# EAGLE design TSOC-FTDI-BASE-2-0 (EAGLE 6.6.0)
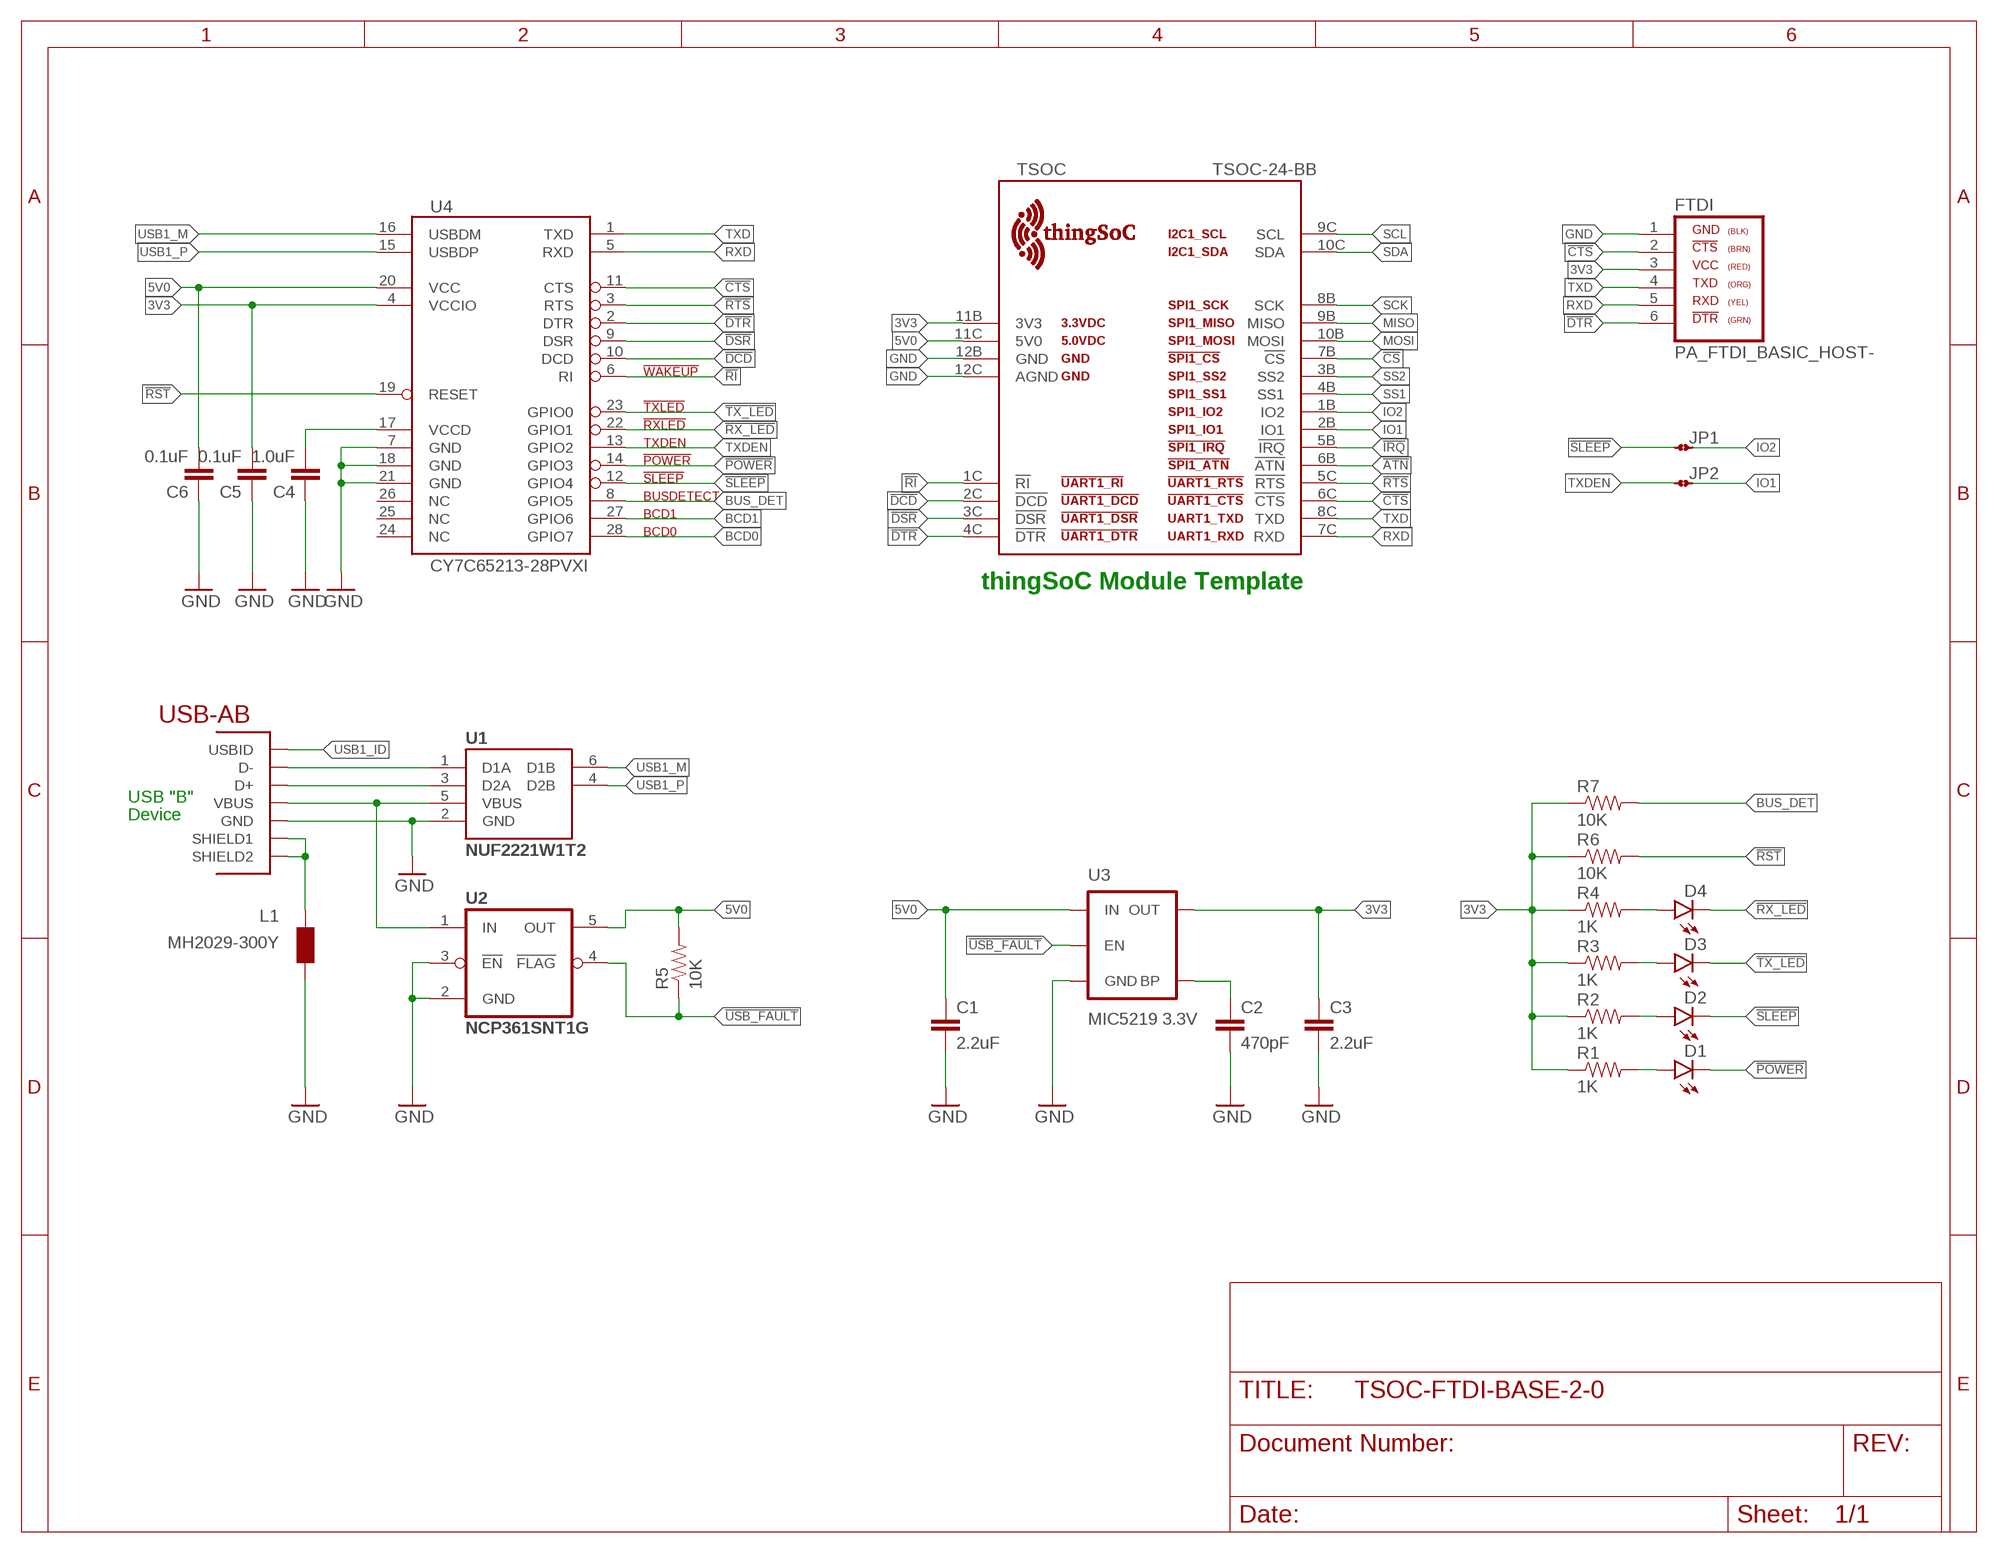
[diagram p0: schematic, sheet 1]

## Parts
C1  2.2uF  CAP0603-CAP  [0603-CAP]
C2  470pF  CAP0603-CAP  [0603-CAP]
C3  2.2uF  CAP0603-CAP  [0603-CAP]
C4  1.0uF  CAP0603-CAP  [0603-CAP]
C5  0.1uF  CAP0603-CAP  [0603-CAP]
C6  0.1uF  CAP0603-CAP  [0603-CAP]
D1  LED0603  [LED-0603]
D2  LED0603  [LED-0603]
D3  LED0603  [LED-0603]
D4  LED0603  [LED-0603]
FTDI  PA_FTDI_BASIC_HOST-  [PA_FTDI_M5X1]
JP1  JMP-2-NO  [JMP-2-NO]
JP2  JMP-2-NO  [JMP-2-NO]
L1  MH2029-300Y  WE-CBF_0805  [0805]
R1  1K  RESISTOR0603-RES  [0603-RES]
R2  1K  RESISTOR0603-RES  [0603-RES]
R3  1K  RESISTOR0603-RES  [0603-RES]
R4  1K  RESISTOR0603-RES  [0603-RES]
R5  10K  RESISTOR0603-RES  [0603-RES]
R6  10K  RESISTOR0603-RES  [0603-RES]
R7  10K  RESISTOR0603-RES  [0603-RES]
TSOC  TSOC-24-BB  [TSOC-BB-S24]
U1  NUF2221W1T2  [SOT-363]
U2  NCP361SNT1G  [SOP95P275X110-5N]
U3  MIC5219 3.3V  V_REG_MIC52193.3V  [SOT23-5]
U4  CY7C65213-28PVXI  [SSOP28DB]
USB1  USB_AB  [USB-AB-MICRO-SMD]

## Nets
3V3: C3.1 C5.2 FTDI.3 R1.1 R2.1 R3.1 R4.1 R6.1 R7.1 TSOC.11B(3V3) U3.5(OUT) U4.4(VCCIO)
5V0: C1.1 C6.2 R5.2 TSOC.11C(5V0) U2.5(OUT) U3.1(IN) U4.20(VCC)
!ATN: TSOC.6B(!ATN)
!CS: TSOC.7B(!CS)
!CTS: FTDI.2 TSOC.6C(!CTS) U4.11(CTS)
!DCD: TSOC.2C(!DCD) U4.10(DCD)
!DSR: TSOC.3C(!DSR) U4.9(DSR)
!DTR: FTDI.6 TSOC.4C(!DTR) U4.2(DTR)
!IRQ: TSOC.5B(!IRQ)
!POWER: D1.C U4.14(GPIO3)
!RI: TSOC.1C(!RI) U4.6(RI)
!RST: R6.2 U4.19(RESET)
!RTS: TSOC.5C(!RTS) U4.3(RTS)
!RX_LED: D4.C U4.22(GPIO1)
!SLEEP: D2.C JP1.1 U4.12(GPIO4)
!TX_LED: D3.C U4.23(GPIO0)
!USB_FAULT: R5.1 U2.4(!FLAG) U3.3(EN)
BCD0: U4.28(GPIO7)
BCD1: U4.27(GPIO6)
BLUE: D3.A R3.2
BUS_DET: R7.2 U4.8(GPIO5)
BYPASS: C2.1 U3.4(BP)
GND [vcc]: C1.2 C2.2 C3.2 C4.1 C5.1 C6.1 FTDI.1 L1.2 TSOC.12B(GND) TSOC.12C(AGND) U1.2(GND) U2.2(GND) U2.3(!EN) U3.2(GND) U4.7(GND) U4.18(GND) U4.21(GND) USB1.GND
GRN: D1.A R1.2
IO1: JP2.2 TSOC.2B(IO1)
IO2: JP1.2 TSOC.1B(IO2)
MISO: TSOC.9B(MISO)
MOSI: TSOC.10B(MOSI)
RED: D2.A R2.2
RXD: FTDI.5 TSOC.7C(RXD) U4.5(RXD)
SCK: TSOC.8B(SCK)
SCL: TSOC.9C(SCL)
SDA: TSOC.10C(SDA)
SS1: TSOC.4B(SS1)
SS2: TSOC.3B(SS2)
TXD: FTDI.4 TSOC.8C(TXD) U4.1(TXD)
TXDEN: JP2.1 U4.13(GPIO2)
USB1_DM: U1.1(D1A) USB1.D-
USB1_DP: U1.3(D2A) USB1.D+
USB1_ID: USB1.ID(USBID)
USB1_M: U1.6(D1B) U4.16(USBDM)
USB1_P: U1.4(D2B) U4.15(USBDP)
USB1_SHIELD: L1.1 USB1.SHIELD1 USB1.SHIELD2
USB1_VBUS: U1.5(VBUS) U2.1(IN) USB1.VBUS
VCCD: C4.2 U4.17(VCCD)
YEL: D4.A R4.2
Unconnected: U4.24(NC) U4.25(NC) U4.26(NC)

## Notes on the sheet
- thingSoC Module Template
- USB "B"
- Device

## Library data of the parts
C1-C6 = PatternAgents-ProtoPads:CAP: Capacitor Standard 0603 ceramic capacitor, and 0.1" leaded capacitor.
D1-D4 = SparkFun-LED:LED: LEDs Standard schematic elements and footprints for 5mm, 3mm, 1206, and 0603 sized LEDs. 5mm - Spark Fun Electronics SKU : COM-00529 (and others)
FTDI = PatternAgents-Interface:PA_FTDI_BASIC_HOST: PatternAgents FTDI UART BASIC Pattern Pinout for "BASIC" FTDI USB-UART adaptor from Sparkfun and others. Source LBR : http://www.patternagents.com Github : https://github.com/patternagents Source Data : http://www.sparkfun.com/datasheets/DevTools/Arduino/FTDI%20Basic-v21-5V.pdf PA Pattern License : http://creativecommons.org/licenses/by-sa/4.0/ (Creative Commons 4.0) THIS SOFTWARE IS PROVIDED BY THE CONTRIBUTORS "AS IS" AND WITHOUT ANY EXPRESS OR IMPLIED WARRANTIES, INCLUDING, BUT NOT LIMITED TO, THE IMPLIED WARRANTIES OF MERCHANTABILITY AND FITNESS FOR A PARTICULAR PURPOSE ARE DISCLAIMED. IN NO EVENT SHALL THE COPYRIGHT OWNER OR CONTRIBUTORS BE LIABLE FOR ANY DIRECT, INDIRECT, INCIDENTAL, SPECIAL, EXEMPLARY, OR CONSEQUENTIAL DAMAGES (INCLUDING, BUT NOT LIMITED TO, PROCUREMENT OF SUBSTITUTE GOODS OR SERVICES; LOSS OF USE, DATA, OR PROFITS; OR BUSINESS INTERRUPTION) HOWEVER CAUSED AND ON ANY THEORY OF LIABILITY, WHETHER IN CONTRACT, STRICT LIABILITY, OR TORT (INCLUDING NEGLIGENCE OR OTHERWISE) ARISING IN ANY WAY OUT OF THE USE OF THIS SOFTWARE, EVEN IF ADVISED OF THE POSSIBILITY OF SUCH DAMAGE.
JP1 JP2 = PatternAgents-ProtoPads:JMP-2-NO: Two Terminal Jumper - Normally Open Positions 1 and 2 are normally NOT connected. PatternAgents ProtoPads Library Schematic and PCB layout libraries for design patterns by PatternAgents. For the CADSoft Eagle CAD program : http://www.cadsoftusa.com/download-eagle/ Source LBR : http://www.patternagents.com Github : https://github.com/PatternAgents License : http://creativecommons.org/licenses/by-sa/4.0/ (Creative Commons 4.0) THIS SOFTWARE IS PROVIDED BY THE CONTRIBUTORS "AS IS" AND WITHOUT ANY EXPRESS OR IMPLIED WARRANTIES, INCLUDING, BUT NOT LIMITED TO, THE IMPLIED WARRANTIES OF MERCHANTABILITY AND FITNESS FOR A PARTICULAR PURPOSE ARE DISCLAIMED. IN NO EVENT SHALL THE COPYRIGHT OWNER OR CONTRIBUTORS BE LIABLE FOR ANY DIRECT, INDIRECT, INCIDENTAL, SPECIAL, EXEMPLARY, OR CONSEQUENTIAL DAMAGES (INCLUDING, BUT NOT LIMITED TO, PROCUREMENT OF SUBSTITUTE GOODS OR SERVICES; LOSS OF USE, DATA, OR PROFITS; OR BUSINESS INTERRUPTION) HOWEVER CAUSED AND ON ANY THEORY OF LIABILITY, WHETHER IN CONTRACT, STRICT LIABILITY, OR TORT (INCLUDING NEGLIGENCE OR OTHERWISE) ARISING IN ANY WAY OUT OF THE USE OF THIS SOFTWARE, EVEN IF ADVISED OF THE POSSIBILITY OF SUCH DAMAGE.; BOM: EXCLUDE
L1 = wuerth-elektronik:WE-CBF: SMD EMI Suppression Ferrite Beads - excellent anti-EMI properties - low DCR - impedances till 3000 ohms - rated current up to 6 A
R1-R7 = PatternAgents-ProtoPads:RESISTOR: Resistor Basic schematic elements and footprints for 0603, 1206, and PTH resistors.
TSOC = thingSoC:TSOC-24: thingSoC Twenty-Four(24) Pin Socket Source LBR : http://www.thingsoc.com Github : https://github.com/thingsoc License : http://creativecommons.org/licenses/by-sa/4.0/ (Creative Commons 4.0) THIS SOFTWARE IS PROVIDED BY THE CONTRIBUTORS "AS IS" AND WITHOUT ANY EXPRESS OR IMPLIED WARRANTIES, INCLUDING, BUT NOT LIMITED TO, THE IMPLIED WARRANTIES OF MERCHANTABILITY AND FITNESS FOR A PARTICULAR PURPOSE ARE DISCLAIMED. IN NO EVENT SHALL THE COPYRIGHT OWNER OR CONTRIBUTORS BE LIABLE FOR ANY DIRECT, INDIRECT, INCIDENTAL, SPECIAL, EXEMPLARY, OR CONSEQUENTIAL DAMAGES (INCLUDING, BUT NOT LIMITED TO, PROCUREMENT OF SUBSTITUTE GOODS OR SERVICES; LOSS OF USE, DATA, OR PROFITS; OR BUSINESS INTERRUPTION) HOWEVER CAUSED AND ON ANY THEORY OF LIABILITY, WHETHER IN CONTRACT, STRICT LIABILITY, OR TORT (INCLUDING NEGLIGENCE OR OTHERWISE) ARISING IN ANY WAY OUT OF THE USE OF THIS SOFTWARE, EVEN IF ADVISED OF THE POSSIBILITY OF SUCH DAMAGE.
U1 = PatternAgents-OnSemi:NUF2221W1T2: NUF2221W1T2 USB ESD Protection, EMI FIlter, and Line Termination
U2 = PatternAgents-OnSemi:NCP361SNT1G: USB Positive Overvoltage Protection Controller; MPN: NCP361SNT1G; OC_FARNELL: 1642242; OC_NEWARK: 01P0135; PACKAGE: TSOP-5; SUPPLIER: ON Semiconductor
U3 = SparkFun-PowerIC:V_REG_MIC5219: V_REG MIC5219 Standard 3.3V and 5V 500mA LDO voltage regulator in SOT-23 layout. Micrel part MIC5219. BP (by-pass) pin is used to lower output noise with 470pF cap, may be left open.; PROD_ID: VREG-09872
U4 = PatternAgents-Cypress:CY7C65213-28: Cypress EZ-USB ® CY7C65213-28SSOP USB TO UART BRIDGE Full-Speed USB Peripheral Controller Source Data: http://www.cypress.com/?mpn=CY7C65213-28xxxx LBR Source: http://www.patternagents.com THIS SOFTWARE IS PROVIDED BY THE CONTRIBUTORS "AS IS" AND WITHOUT ANY EXPRESS OR IMPLIED WARRANTIES, INCLUDING, BUT NOT LIMITED TO, THE IMPLIED WARRANTIES OF MERCHANTABILITY AND FITNESS FOR A PARTICULAR PURPOSE ARE DISCLAIMED. IN NO EVENT SHALL THE COPYRIGHT OWNER OR CONTRIBUTORS BE LIABLE FOR ANY DIRECT, INDIRECT, INCIDENTAL, SPECIAL, EXEMPLARY, OR CONSEQUENTIAL DAMAGES (INCLUDING, BUT NOT LIMITED TO, PROCUREMENT OF SUBSTITUTE GOODS OR SERVICES; LOSS OF USE, DATA, OR PROFITS; OR BUSINESS INTERRUPTION) HOWEVER CAUSED AND ON ANY THEORY OF LIABILITY, WHETHER IN CONTRACT, STRICT LIABILITY, OR TORT (INCLUDING NEGLIGENCE OR OTHERWISE) ARISING IN ANY WAY OUT OF THE USE OF THIS SOFTWARE, EVEN IF ADVISED OF THE POSSIBILITY OF SUCH DAMAGE.
USB1 = BeeSafe:USB_AB: This is a USB AB connector that is compatible with USB OTG. i.e. this connector can serve as a host or device

## Net classes
1 vcc: width 0.254 mm

## Board
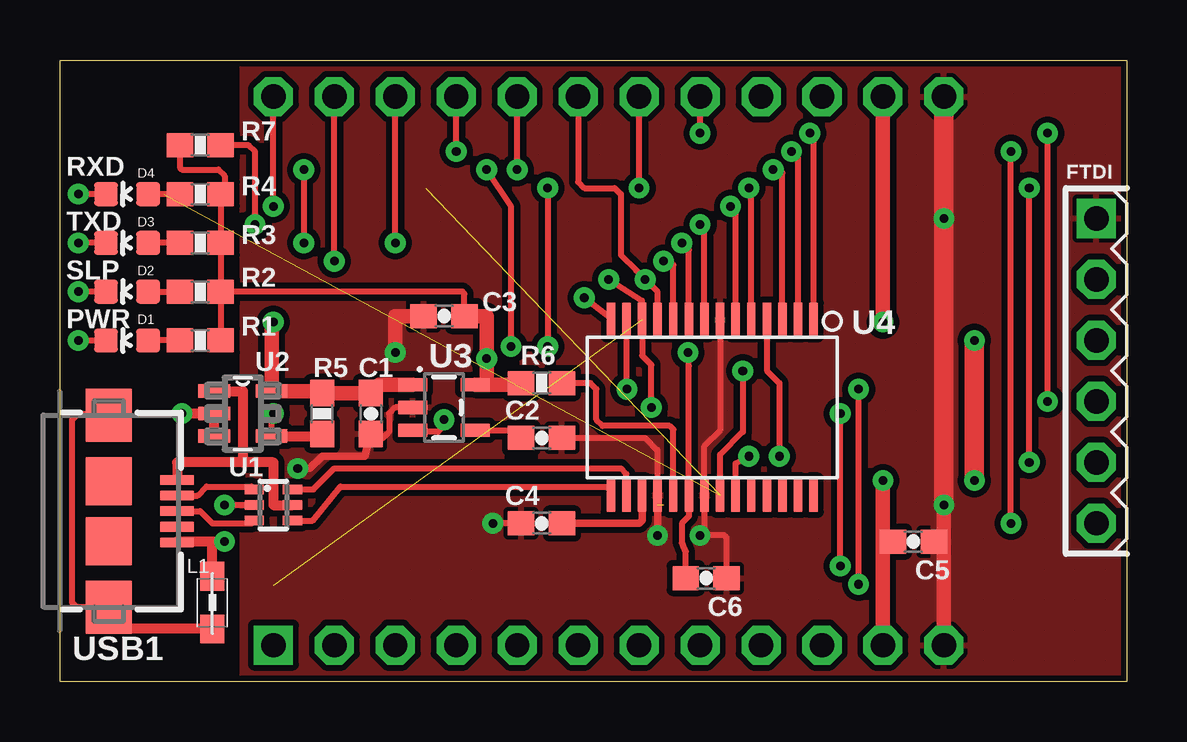
[diagram p1: board, top side]
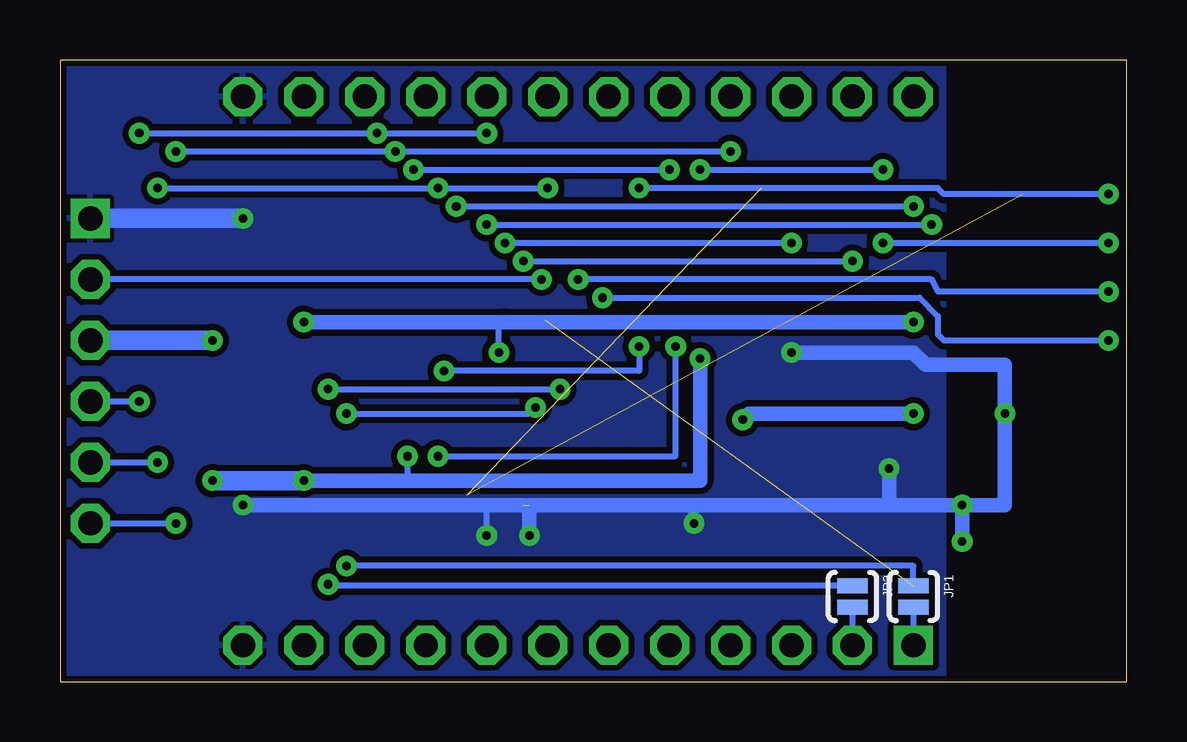
[diagram p2: board, bottom side, seen from below]

Size 44.45 x 25.91 mm. Coordinates in mm from the lower left corner, seen from the top.
Outline: 0,0 0,25.91 44.45,25.91 44.45,0 0,0
Copper layers (1*16): Top 0.035mm / dielectric 1.5mm / Bottom 0.035mm
Design rules "PatternAgents_7mil": minimum track width 7mil, minimum drill 14mil, track to track 7mil, track to pad 7mil, pad to pad 7mil, via to via 7mil, smd to smd 7mil, copper to edge 7mil, drill to drill 7mil, minimum pad ring 12mil, minimum via ring 10mil, stop-mask expansion 4mil, vias tented up to drill 25mil, thermal gap 7mil

### Footprints (pad centres in the part's own frame; a part is rotated, then mirrored left to right if it is on the bottom)
0603-CAP = smd 1.1 x 1: 1 -0.85,0; 2 0.85,0
LED-0603 = smd 1 x 1: A 0,-0.877; C 0,0.877
PA_FTDI_M5X1 = drill 1.016 square: 1 -1.27,6.35 | drill 1.016 octagon: 2 -1.27,3.81; 3 -1.27,1.27; 4 -1.27,-1.27; 5 -1.27,-3.81; 6 -1.27,-6.35
JMP-2-NO = smd 0.635 x 1.27: 1 -0.45,0; 2 0.45,0
0805 = smd 1.2 x 1: 1 -1.1,0; 2 1.1,0
0603-RES = smd 1.1 x 1: 1 -0.85,0; 2 0.85,0
TSOC-BB-S24 = drill 1.016 square: 1B -11.43,-11.43 | drill 1.016 octagon: 1C -11.43,11.43; 2B -8.89,-11.43; 2C -8.89,11.43; 3B -6.35,-11.43; 3C -6.35,11.43; 4B -3.81,-11.43; 4C -3.81,11.43; 5B -1.27,-11.43; 5C -1.27,11.43; 6B 1.27,-11.43; 6C 1.27,11.43; 7B 3.81,-11.43; 7C 3.81,11.43; 8B 6.35,-11.43; 8C 6.35,11.43; 9B 8.89,-11.43; 9C 8.89,11.43; 10B 11.43,-11.43; 10C 11.43,11.43; 11B 13.97,-11.43; 11C 13.97,11.43; 12B 16.51,-11.43; 12C 16.51,11.43
SOT-363 = smd 0.4 x 0.8: 1 -0.65,-0.8; 2 0,-0.8; 3 0.65,-0.8; 4 0.65,0.8; 5 0,0.8; 6 -0.65,0.8
SOP95P275X110-5N = smd 1.321 x 0.559: 1 -1.194,0.94; 2 -1.194,0; 3 -1.194,-0.94; 4 1.194,-0.94; 5 1.194,0.94
SOT23-5 = smd 0.55 x 1.2: 1 -0.95,-1.3; 2 0,-1.3; 3 0.95,-1.3; 4 0.95,1.3; 5 -0.95,1.3
SSOP28DB = smd 0.348 x 1.397: 1 -4.225,-3.656; 2 -3.575,-3.656; 3 -2.925,-3.656; 4 -2.275,-3.656; 5 -1.625,-3.656; 6 -0.975,-3.656; 7 -0.325,-3.656; 8 0.325,-3.656; 9 0.975,-3.656; 10 1.625,-3.656; 11 2.275,-3.656; 12 2.925,-3.656; 13 3.575,-3.656; 14 4.225,-3.656; 15 4.225,3.656; 16 3.575,3.656; 17 2.925,3.656; 18 2.275,3.656; 19 1.625,3.656; 20 0.975,3.656; 21 0.325,3.656; 22 -0.325,3.656; 23 -0.975,3.656; 24 -1.625,3.656; 25 -2.275,3.656; 26 -2.925,3.656; 27 -3.575,3.656; 28 -4.225,3.656
USB-AB-MICRO-SMD = smd 1.4 x 0.4: D+ 2.85,0; D- 2.85,0.65; GND 2.85,-1.3; ID 2.85,-0.65; VBUS 2.85,1.3 | smd 1.9 x 2: P$6 0,1.25; P$7 0,-1.25 | smd 1.9 x 2.2: SHIELD1 0,4; SHIELD2 0,-4

### Placement (x,y rotation side)
C1  12.95,11.18 270 top
C2  20.07,10.16 0 top
C3  16,15.24 180 top
C4  20.07,6.6 0 top
C5  35.56,5.84 180 top
C6  26.92,4.32 180 top
D1  2.79,14.22 90 top
D2  2.79,16.26 90 top
D3  2.79,18.29 90 top
D4  2.79,20.32 90 top
FTDI  44.45,12.95 0 top
JP1  8.89,3.56 270 bottom
JP2  11.43,3.56 270 bottom
L1  6.35,3.3 90 top
R1  5.84,14.22 180 top
R2  5.84,16.26 180 top
R3  5.84,18.29 180 top
R4  5.84,20.32 180 top
R5  10.92,11.18 90 top
R6  20.07,12.45 0 top
R7  5.84,22.35 0 top
TSOC  20.32,12.95 0 top
U1  8.89,7.37 270 top
U2  7.62,11.18 0 top
U3  16,11.43 270 top
U4  27.18,11.43 180 top
USB1  2.03,7.11 0 top

### Tracks (layer width: path | path; a pad name or v marks a point on that pad's centre or on a via)
3V3  (via drill 0.36)
  Top 0.254: 29.96,9.41 v29.97,9.4 29.97,12.45 29.45,12.96 U4.4 | R7.1 4.99,21.42 5.08,21.34 6.6,21.34 6.86,21.08 6.86,20.49 R4.1 R3.1 R2.1 | R2.1 R1.1 | C3.1 16.85,16.17 16.76,16.26 R2.1
  Top 0.61: R6.1 19.15,12.38 U3.5 17.71,12.38 17.78,12.45 v17.78,13.46 17.78,15.24 C3.1 | TSOC.11B 34.29,5.93 | 34.29,5.93 C5.2 | v34.29,8.38 34.29,5.93
  Top 0.813: v38.1,8.38 v38.1,14.22
  Bottom 0.254: v29.97,9.4 29.97,8.38
  Bottom 0.61: v17.78,13.46 17.78,8.38 29.97,8.38 v34.29,8.38
  Bottom 0.813: v34.29,8.38 v38.1,8.38 | v38.1,14.22 FTDI.3
5V0  (via drill 0.36)
  Top 0.254: v26.16,13.72 26.2,13.17 U4.20 26.2,6.9 25.91,6.6 25.91,5.84 26.07,5.42 C6.2
  Top 0.61: U3.1 13.31,12.38 C1.1 R5.2 10.83,12.12 U2.5 8.81,14.91 v8.89,14.99 | TSOC.11C v34.29,14.99
  Bottom 0.254: v26.16,13.72 26.16,14.73 25.91,14.99
  Bottom 0.61: v34.29,14.99 25.91,14.99 v8.89,14.99
!CTS  (via drill 0.36)
  Top 0.254: TSOC.6C 21.59,20.83 21.84,20.57 23.11,20.57 23.37,20.32 23.37,17.78 24,17.14 v24.38,16.76 24.9,16.25 U4.11
  Bottom 0.254: v24.38,16.76 FTDI.2
!DCD  (via drill 0.36)
  Top 0.254: U4.10 25.55,17.37 v25.15,17.53 | v11.43,17.53 TSOC.2C
  Bottom 0.254: v25.15,17.53 v11.43,17.53
!DSR  (via drill 0.36)
  Top 0.254: U4.9 26.2,17.99 v25.91,18.29 | v13.97,18.29 TSOC.3C
  Bottom 0.254: v25.91,18.29 v13.97,18.29
!DTR  (via drill 0.36)
  Top 0.254: U4.2 30.75,21.83 v30.48,22.1 | v16.51,22.1 TSOC.4C | v39.62,6.6 v39.62,22.1
  Bottom 0.254: v16.51,22.1 v30.48,22.1 v39.62,22.1 | FTDI.6 v39.62,6.6
!POWER  (via drill 0.36)
  Top 0.254: U4.14 22.95,15.15 v21.84,16 | v0.76,14.22 D1.C
  Bottom 0.254: v21.84,16 8.64,16 7.87,15.24 7.87,14.48 7.62,14.22 v0.76,14.22
!RI  (via drill 0.36)
  Top 0.254: U4.6 28.15,19.6 v27.94,19.81 | v8.89,19.81 TSOC.1C
  Bottom 0.254: v27.94,19.81 v8.89,19.81
!RST
  Top 0.254: U4.19 25.55,10.52 25.4,10.67 22.61,10.67 22.35,10.92 22.35,12.19 22.1,12.45 R6.2
!RTS  (via drill 0.36)
  Top 0.254: U4.3 30.1,21.2 v29.72,21.34 | v19.05,21.34 TSOC.5C
  Bottom 0.254: v29.72,21.34 v19.05,21.34
!RX_LED  (via drill 0.36)  (2 unrouted)
  Top 0.254: D4.C v0.76,20.32 | v20.32,20.57 v20.32,13.97 | v28.45,12.95 28.45,10.41 27.5,9.47 U4.22
  Bottom 0.254: v0.76,20.32 7.62,20.32 7.87,20.57 v20.32,20.57 | v20.32,13.97 20.32,12.95 v28.45,12.95
!SLEEP  (via drill 0.36)  (1 unrouted)
  Top 0.254: D2.C v0.76,16.26 | v22.86,16.76 24.25,15.88 U4.12 24.25,13.59 24.64,13.21 v24.64,11.43 | v32.51,4.83 v32.51,11.18
  Bottom 0.254: v0.76,16.26 7.87,16.26 8.13,16.76 v22.86,16.76 | JP1.1 8.89,4.83 v32.51,4.83 | v32.51,11.18 24.89,11.18 v24.64,11.43
!TX_LED  (via drill 0.36)
  Top 0.254: D3.C v0.76,18.29 | U4.23 28.15,9.1 v28.7,9.4 | v18.8,13.97 18.8,19.81 v17.78,21.34 | v10.16,21.34 v10.16,18.29
  Bottom 0.254: v28.7,9.4 18.8,9.4 v18.8,13.97 | v17.78,21.34 v10.16,21.34 | v10.16,18.29 v0.76,18.29
!USB_FAULT  (via drill 0.36)
  Top 0.254: U2.4 8.81,11.1 v8.89,11.18 | v16,10.92 16,10.67 15.75,10.41 14.77,10.41 U3.3
  Top 0.406: U2.4 10.67,10.24 R5.1
  Bottom 0.254: 15.75,11.18 v16,10.92
  Bottom 0.61: v8.89,11.18 15.75,11.18
BLUE
  Top 0.254: R3.2 D3.A
BUS_DET  (via drill 0.36)
  Top 0.254: U4.8 26.85,18.87 v26.67,19.05 | v8.13,19.05 8.13,22.1 7.87,22.35 R7.2
  Bottom 0.254: v26.67,19.05 v8.13,19.05
BYPASS
  Top 0.254: U3.4 18.9,10.48 C2.1
GND  (via drill 0.36)  (1 unrouted)
  Top 0.254: U1.2 v6.86,7.37 | 4.88,5.84 USB1.GND | C4.1 v18.03,6.6 | U3.2 13.97,11.43 13.72,11.18 13.72,10.41 13.46,10.16 13.12,10.16 C1.2 | C2.2 24.38,10.16 24.89,9.65 24.89,7.79 U4.18 | U4.7 27.5,10.49 26.85,9.84 U4.21 26.85,6.28 v26.67,6.1 27.69,6.1 27.77,6.01 C6.1
  Top 0.305: U4.18 24.9,6.11 v24.89,6.1 | v9.91,8.89 10.41,8.89 10.92,9.4 12.7,9.4 C1.2
  Top 0.406: v6.86,5.84 6.35,5.84 | 6.35,5.84 4.88,5.84 | L1.2 6.35,5.84 | v5.08,11.18 U2.2 U2.3
  Top 0.61: TSOC.12B 36.83,5.84 | 36.83,5.84 v36.83,7.37 | C5.1 36.83,5.84 | C3.2 13.97,15.24 v13.97,13.72
  Top 0.813: TSOC.12C v36.83,19.3 v36.83,7.37
  Bottom 0.254: v26.67,6.1 26.67,7.11 26.42,7.37
  Bottom 0.406: v18.03,6.6 18.03,7.37
  Bottom 0.61: v6.86,7.37 v6.86,5.84 | v9.91,8.89 9.91,7.37 | v6.86,7.37 5.08,7.37 v5.08,11.18 5.08,13.21 8.38,13.21 8.89,13.72 v13.97,13.72 | 9.91,7.37 18.03,7.37 24.89,7.37 v24.89,6.1 | v6.86,7.37 9.91,7.37 | v36.83,7.37 26.42,7.37 25.16,7.37
  Bottom 0.813: FTDI.1 v36.83,19.3
  pour Top (isolate 0.254, hatched): 7.62,0 7.62,25.91 44.45,25.91 44.45,0
  pour Bottom (isolate 0.254, hatched): 7.62,0 7.62,20.83 7.62,25.91 44.45,25.91 44.45,0
GRN
  Top 0.254: R1.2 D1.A
IO1
  Bottom 0.254: JP2.2 TSOC.2B
IO2
  Bottom 0.254: JP1.2 TSOC.1B
RED
  Top 0.254: D2.A R2.2
RXD  (via drill 0.36)
  Top 0.254: U4.5 28.8,20.47 v28.7,20.57 | v24.13,20.57 TSOC.7C | v40.39,9.14 v40.39,20.57
  Bottom 0.254: v24.13,20.57 v28.7,20.57 v40.39,20.57 | FTDI.5 v40.39,9.14
TXD  (via drill 0.36)
  Top 0.254: U4.1 31.4,22.7 v31.24,22.86 | v26.67,22.86 TSOC.8C | v41.15,11.68 v41.15,22.86
  Bottom 0.254: v26.67,22.86 v31.24,22.86 v41.15,22.86 | FTDI.4 v41.15,11.68
TXDEN  (via drill 0.36)
  Top 0.254: v33.27,4.06 v33.27,12.19 | v23.62,12.19 23.62,15.07 U4.13
  Bottom 0.254: JP2.1 33.22,4.01 v33.27,4.06 | v33.27,12.19 v23.62,12.19
USB1_DM
  Top 0.254: USB1.D- 5.73,7.76 6.1,8.13 7.98,8.13 U1.1
USB1_DP
  Top 0.254: USB1.D+ 5.84,7.11 6.35,6.6 7.98,6.6 U1.3
USB1_M
  Top 0.254: U1.6 10.56,8.02 11.43,8.89 23.37,8.89 23.6,8.66 U4.16
USB1_P
  Top 0.254: U1.4 10.53,6.72 11.68,8.13 22.85,8.13 U4.15
USB1_SHIELD
  Top 0.254: USB1.SHIELD2 1.52,3.11 0.7,3.11 0.51,3.3 0.51,10.92 0.76,11.18 1.97,11.18 USB1.SHIELD1
  Top 0.406: 1.84,2.79 1.52,3.11 | L1.1 2.03,2.2 USB1.SHIELD2
USB1_VBUS
  Top 0.406: U1.5 8.89,7.37 8.89,9.14 7.62,9.14 | 7.62,9.14 4.88,9.14 USB1.VBUS | U2.1 7.62,12.12 7.62,9.14
VCCD
  Top 0.305: U4.17 24.25,6.73 24.13,6.6 C4.2
YEL
  Top 0.254: R4.2 D4.A

### Text on the board
tPlace: RXD | TXD | SLP | PWR